# EAGLE schematic IGrevator (EAGLE 6.0)
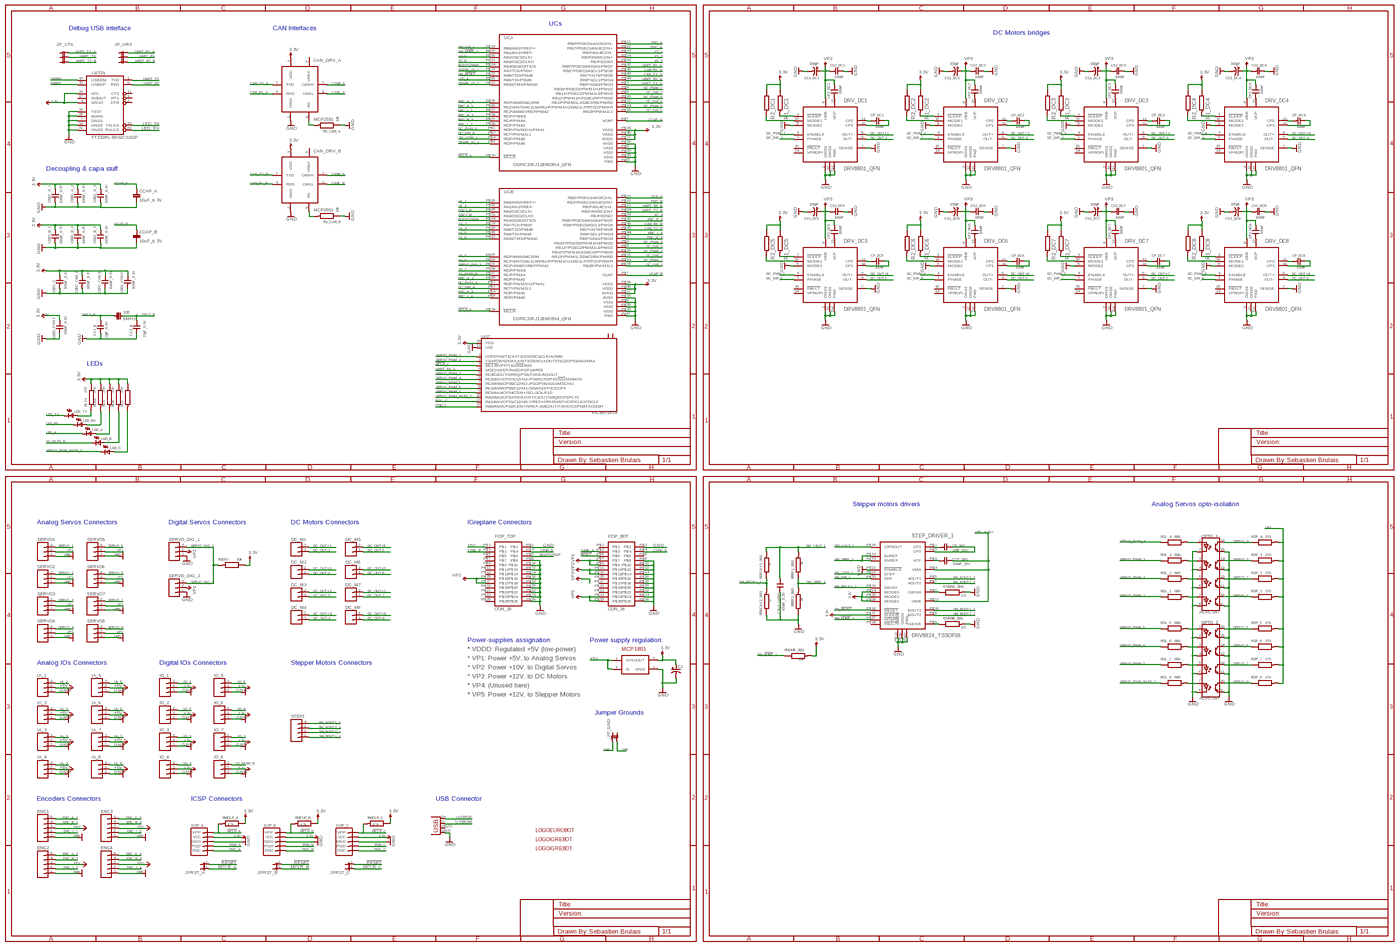
[diagram p0: schematic, sheet 1, overview]
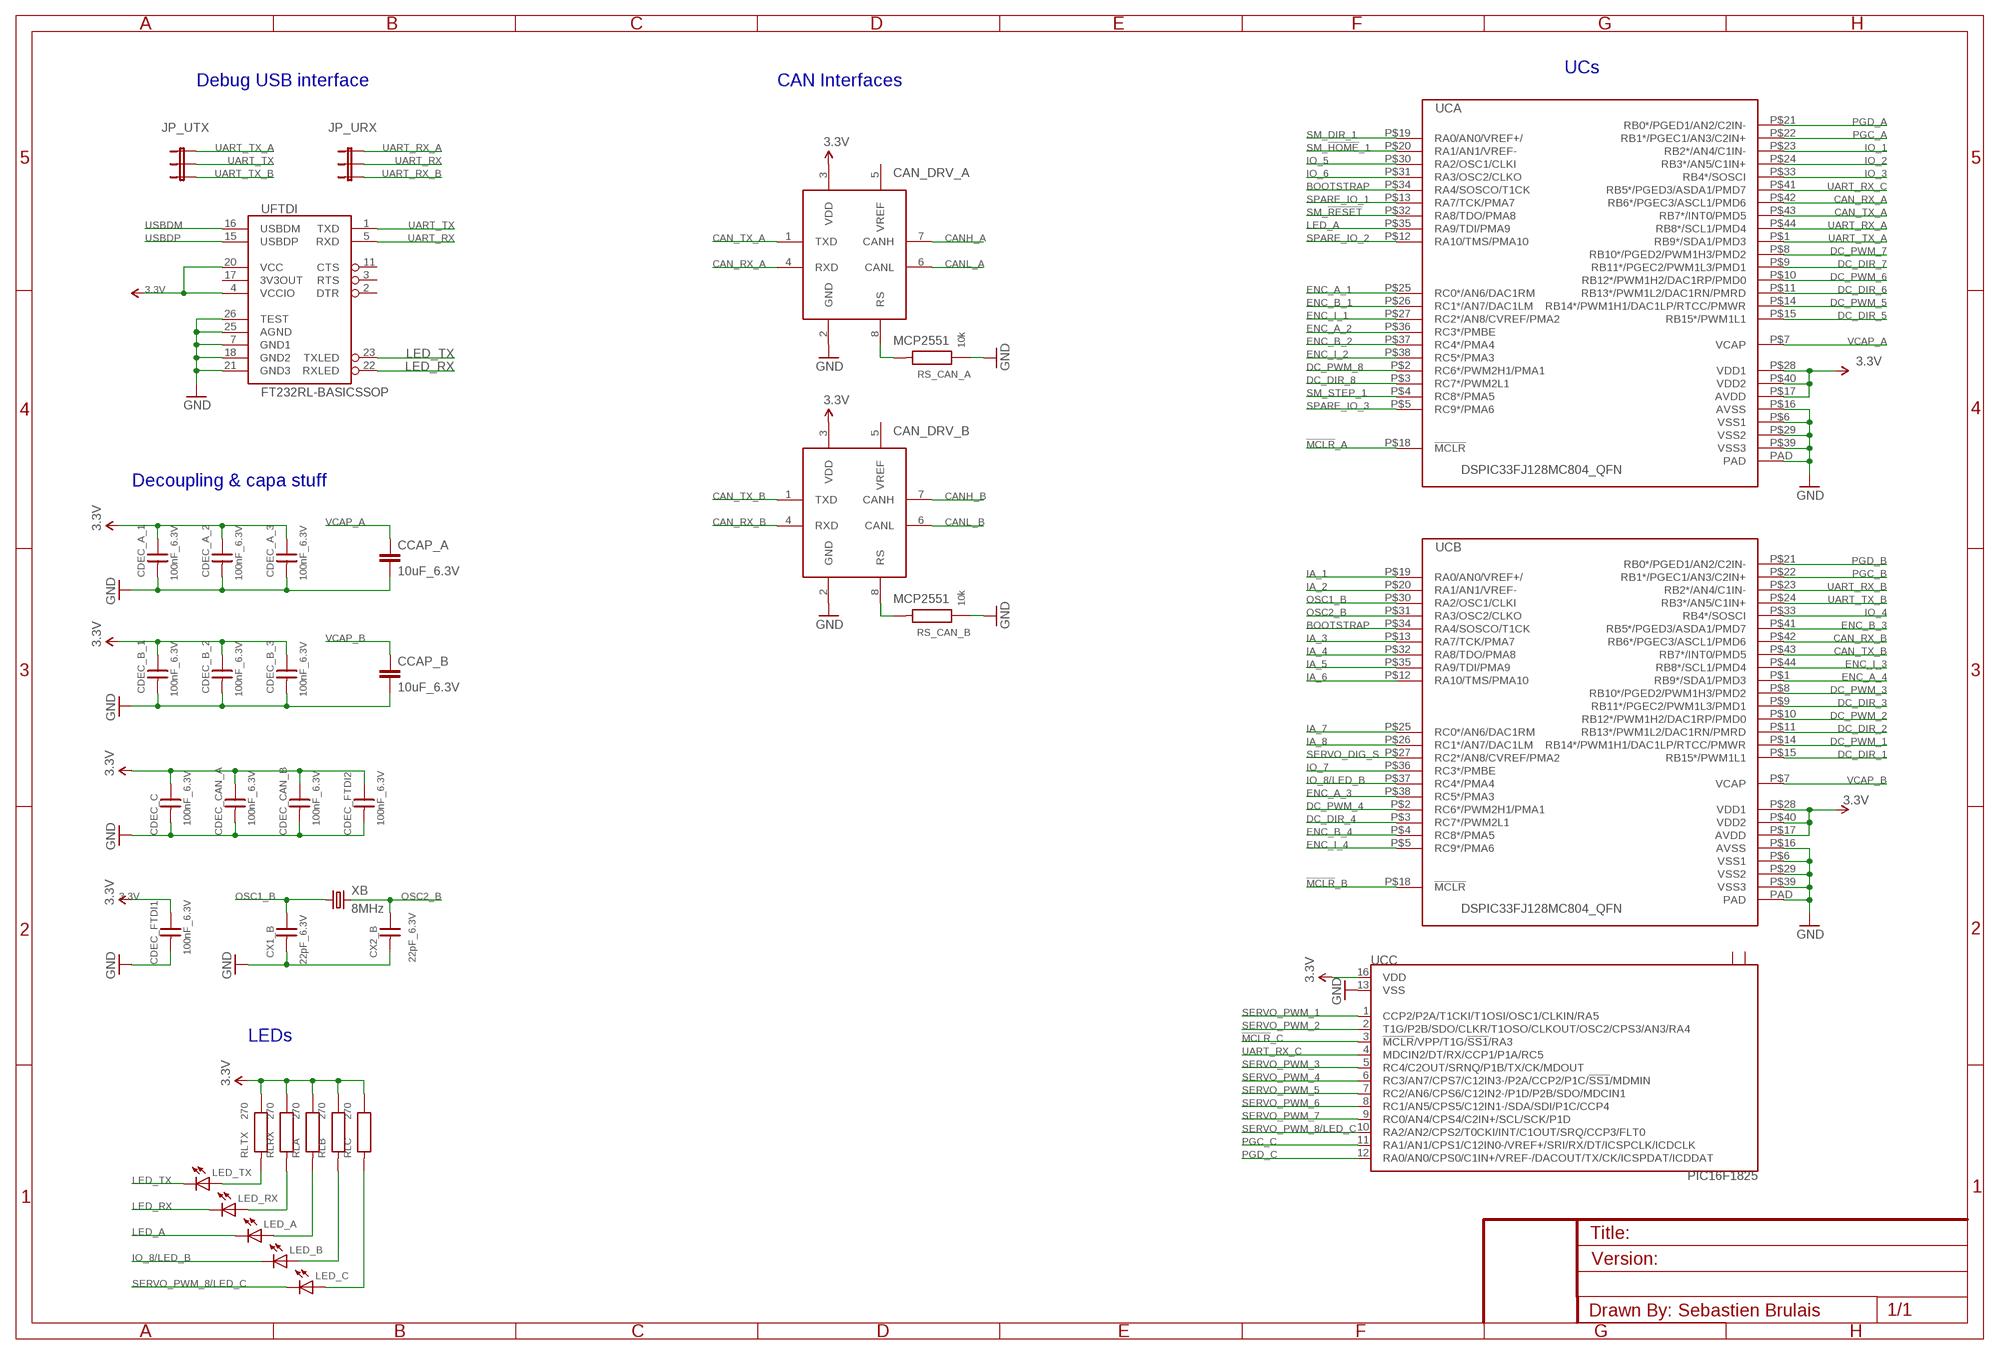
[diagram p1: schematic, sheet 1, part 1 of 4]
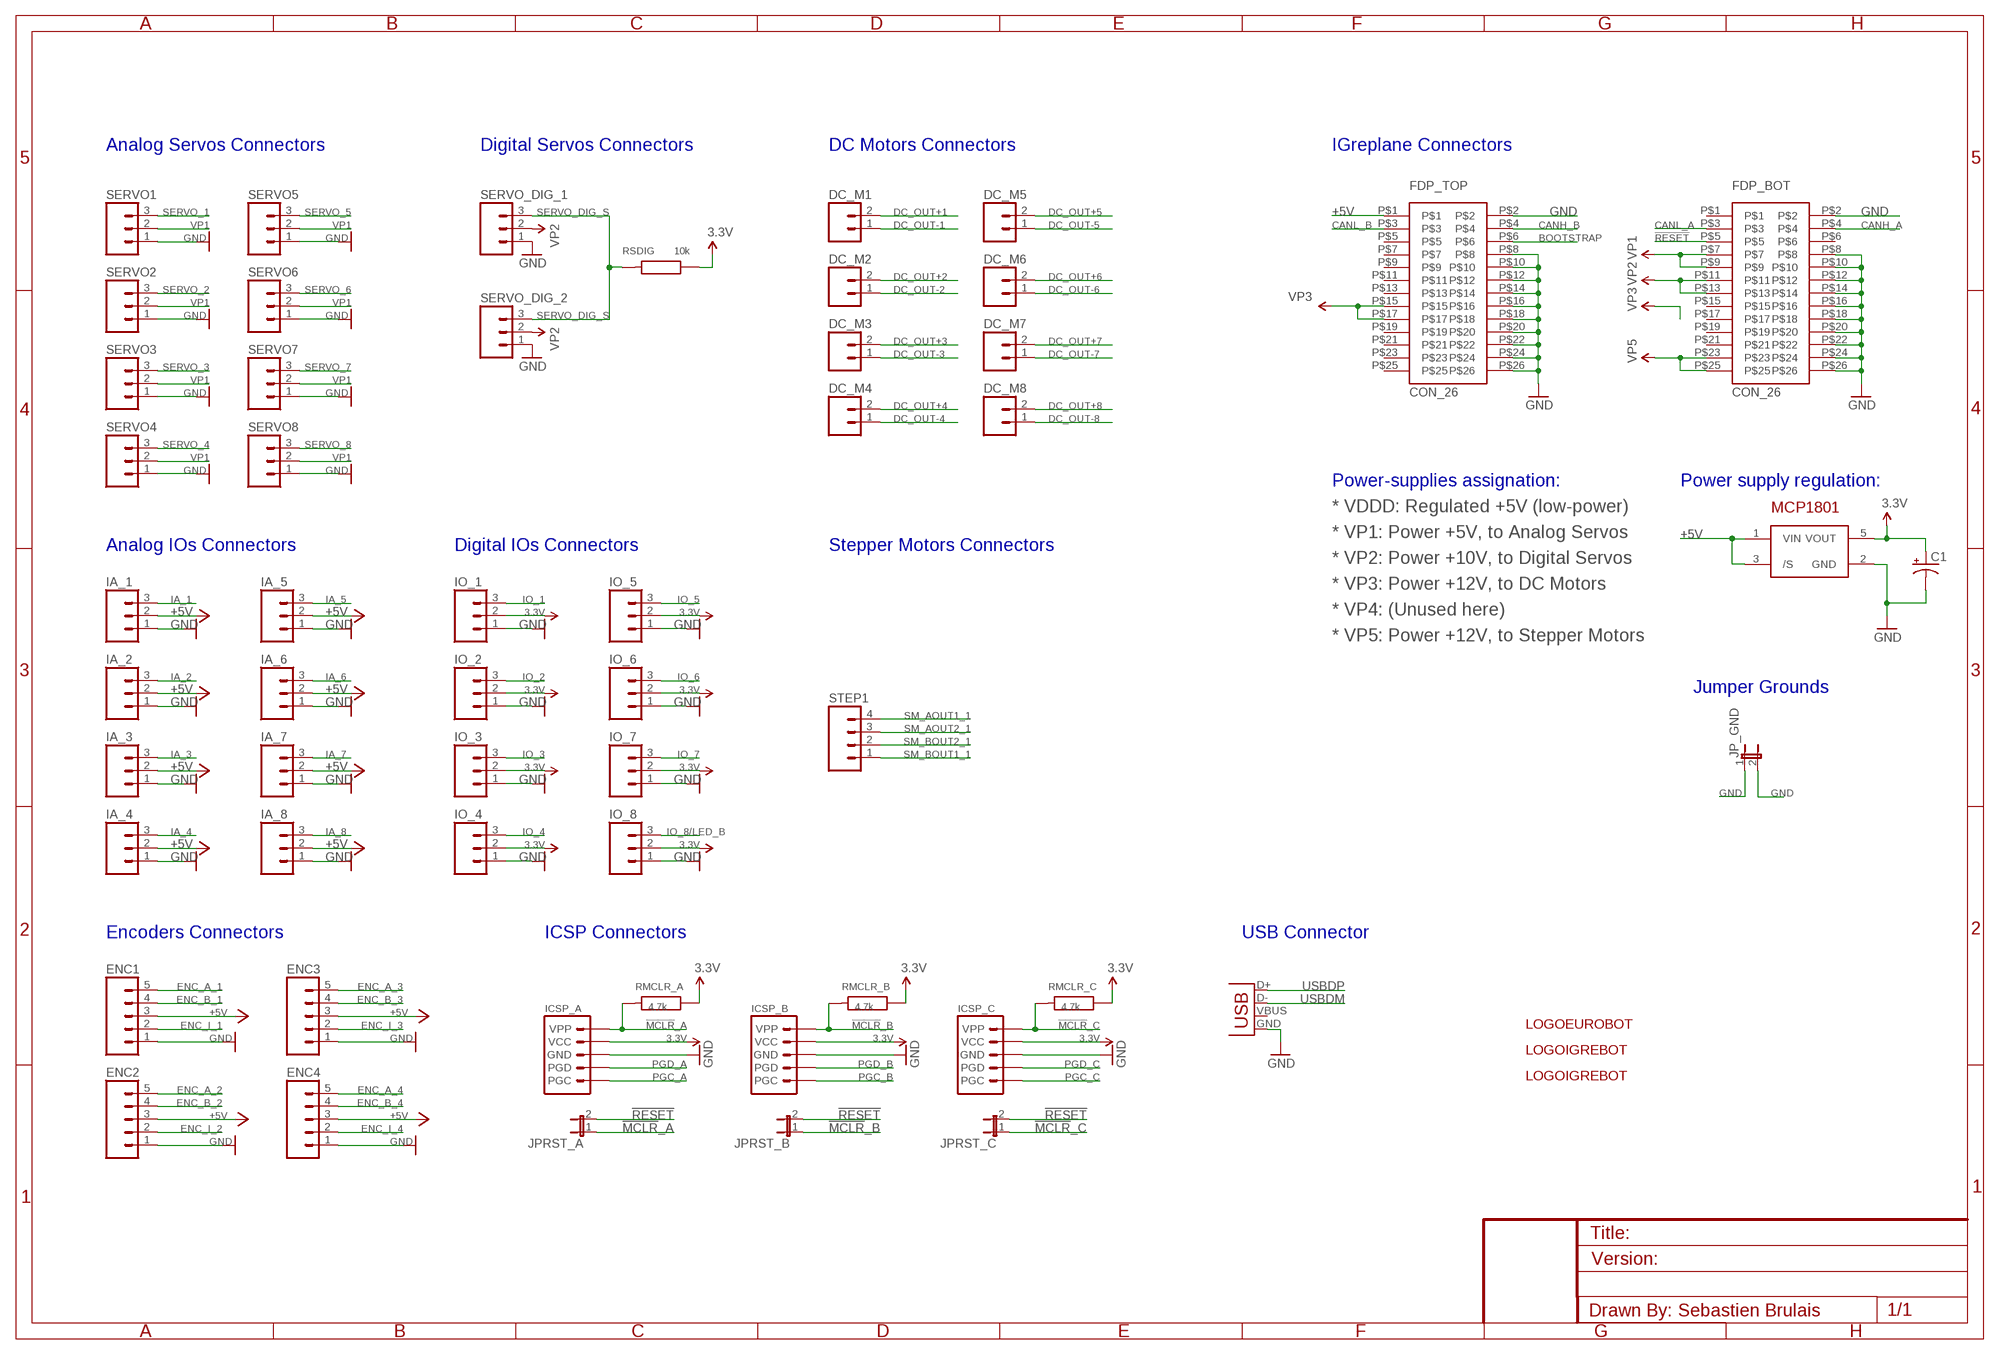
[diagram p2: schematic, sheet 1, part 2 of 4]
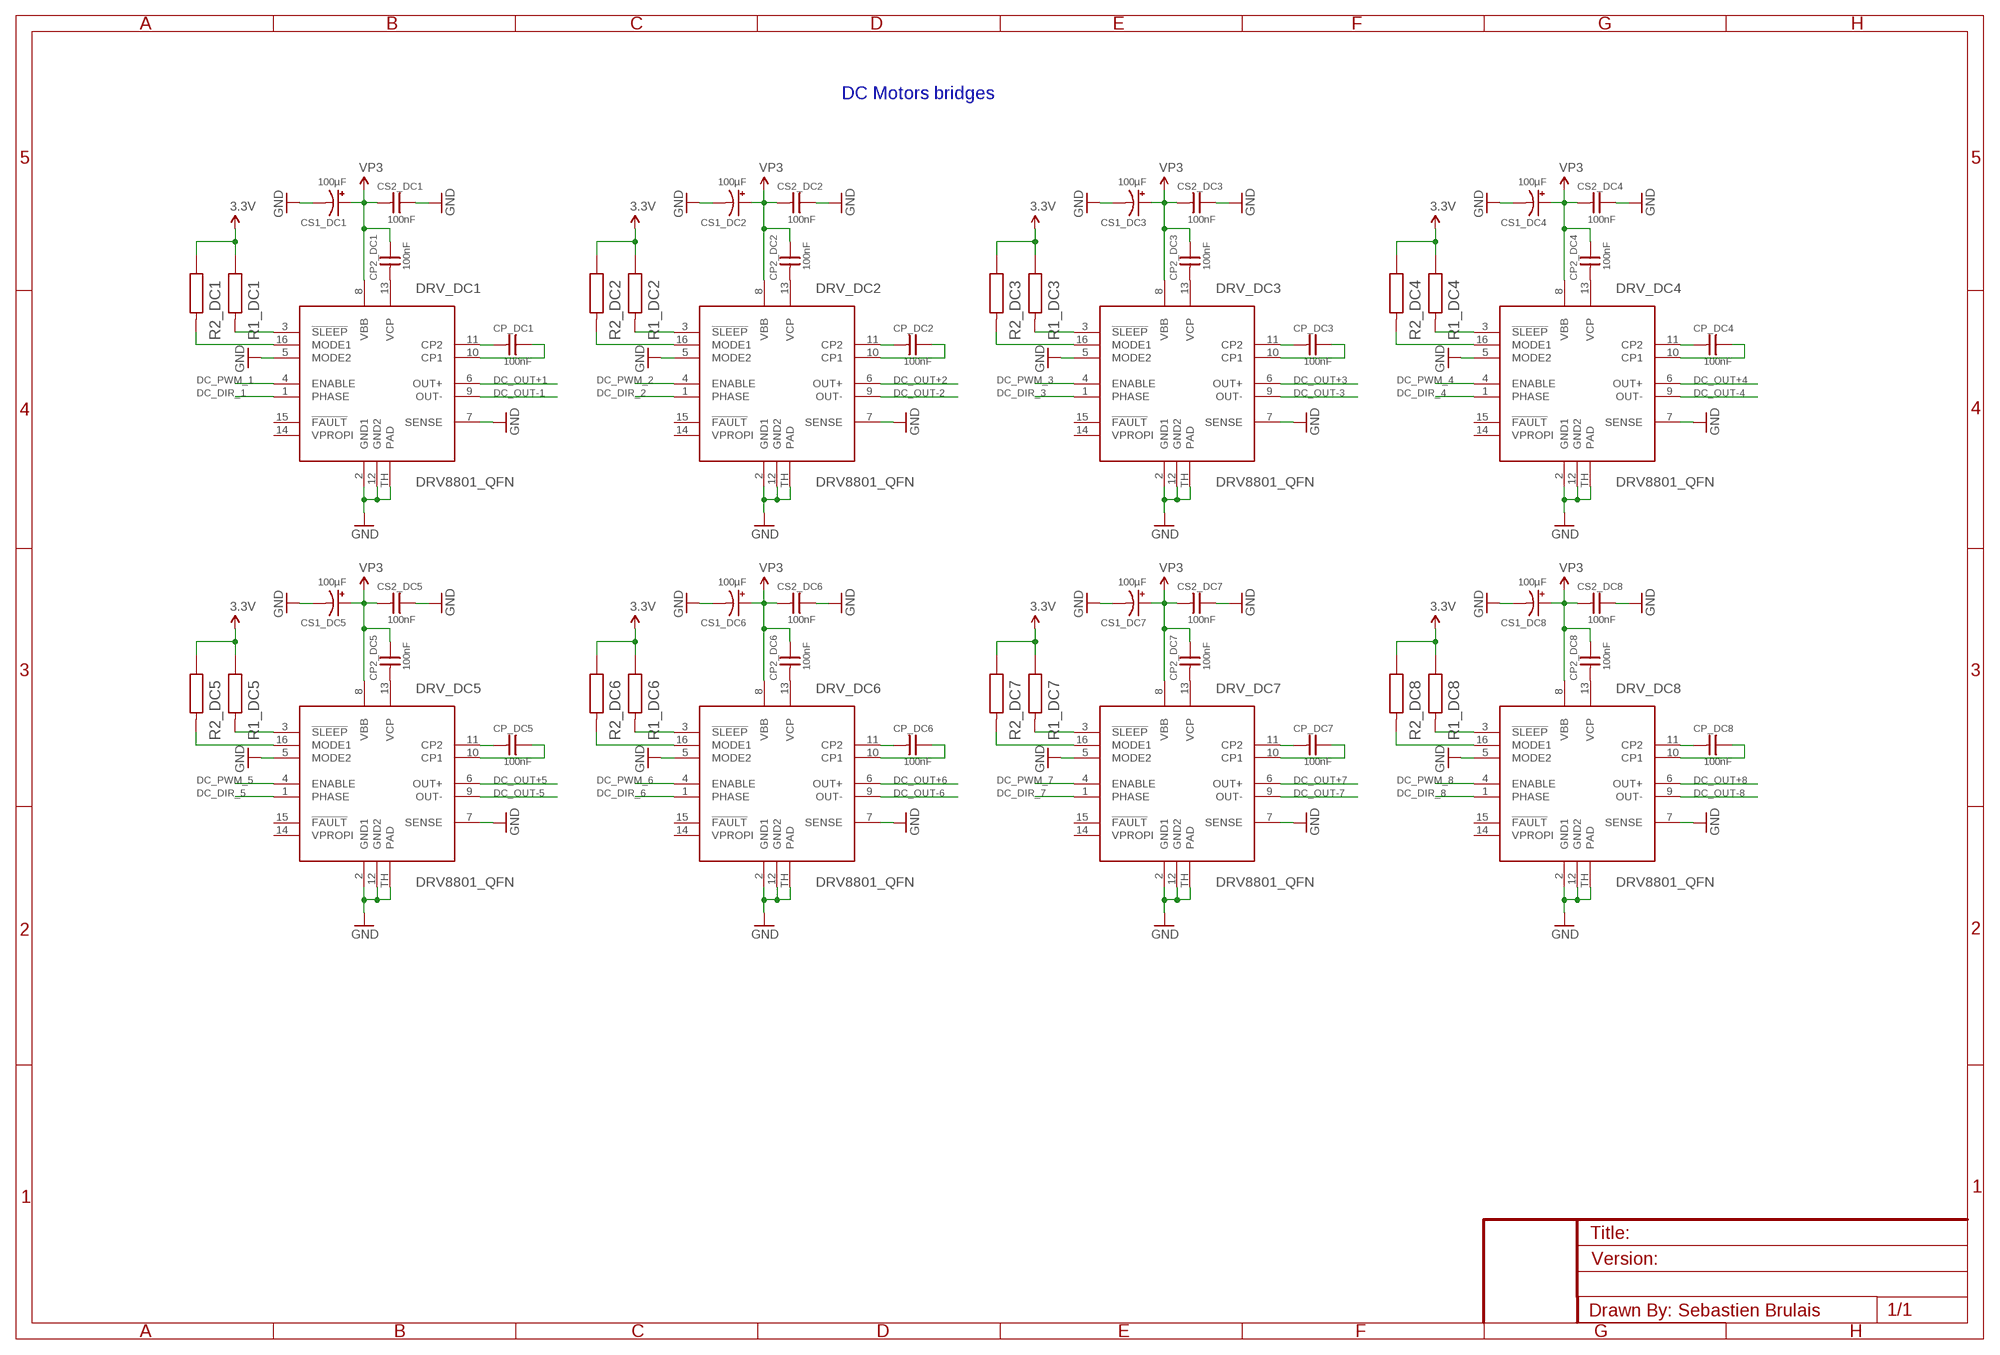
[diagram p3: schematic, sheet 1, part 3 of 4]
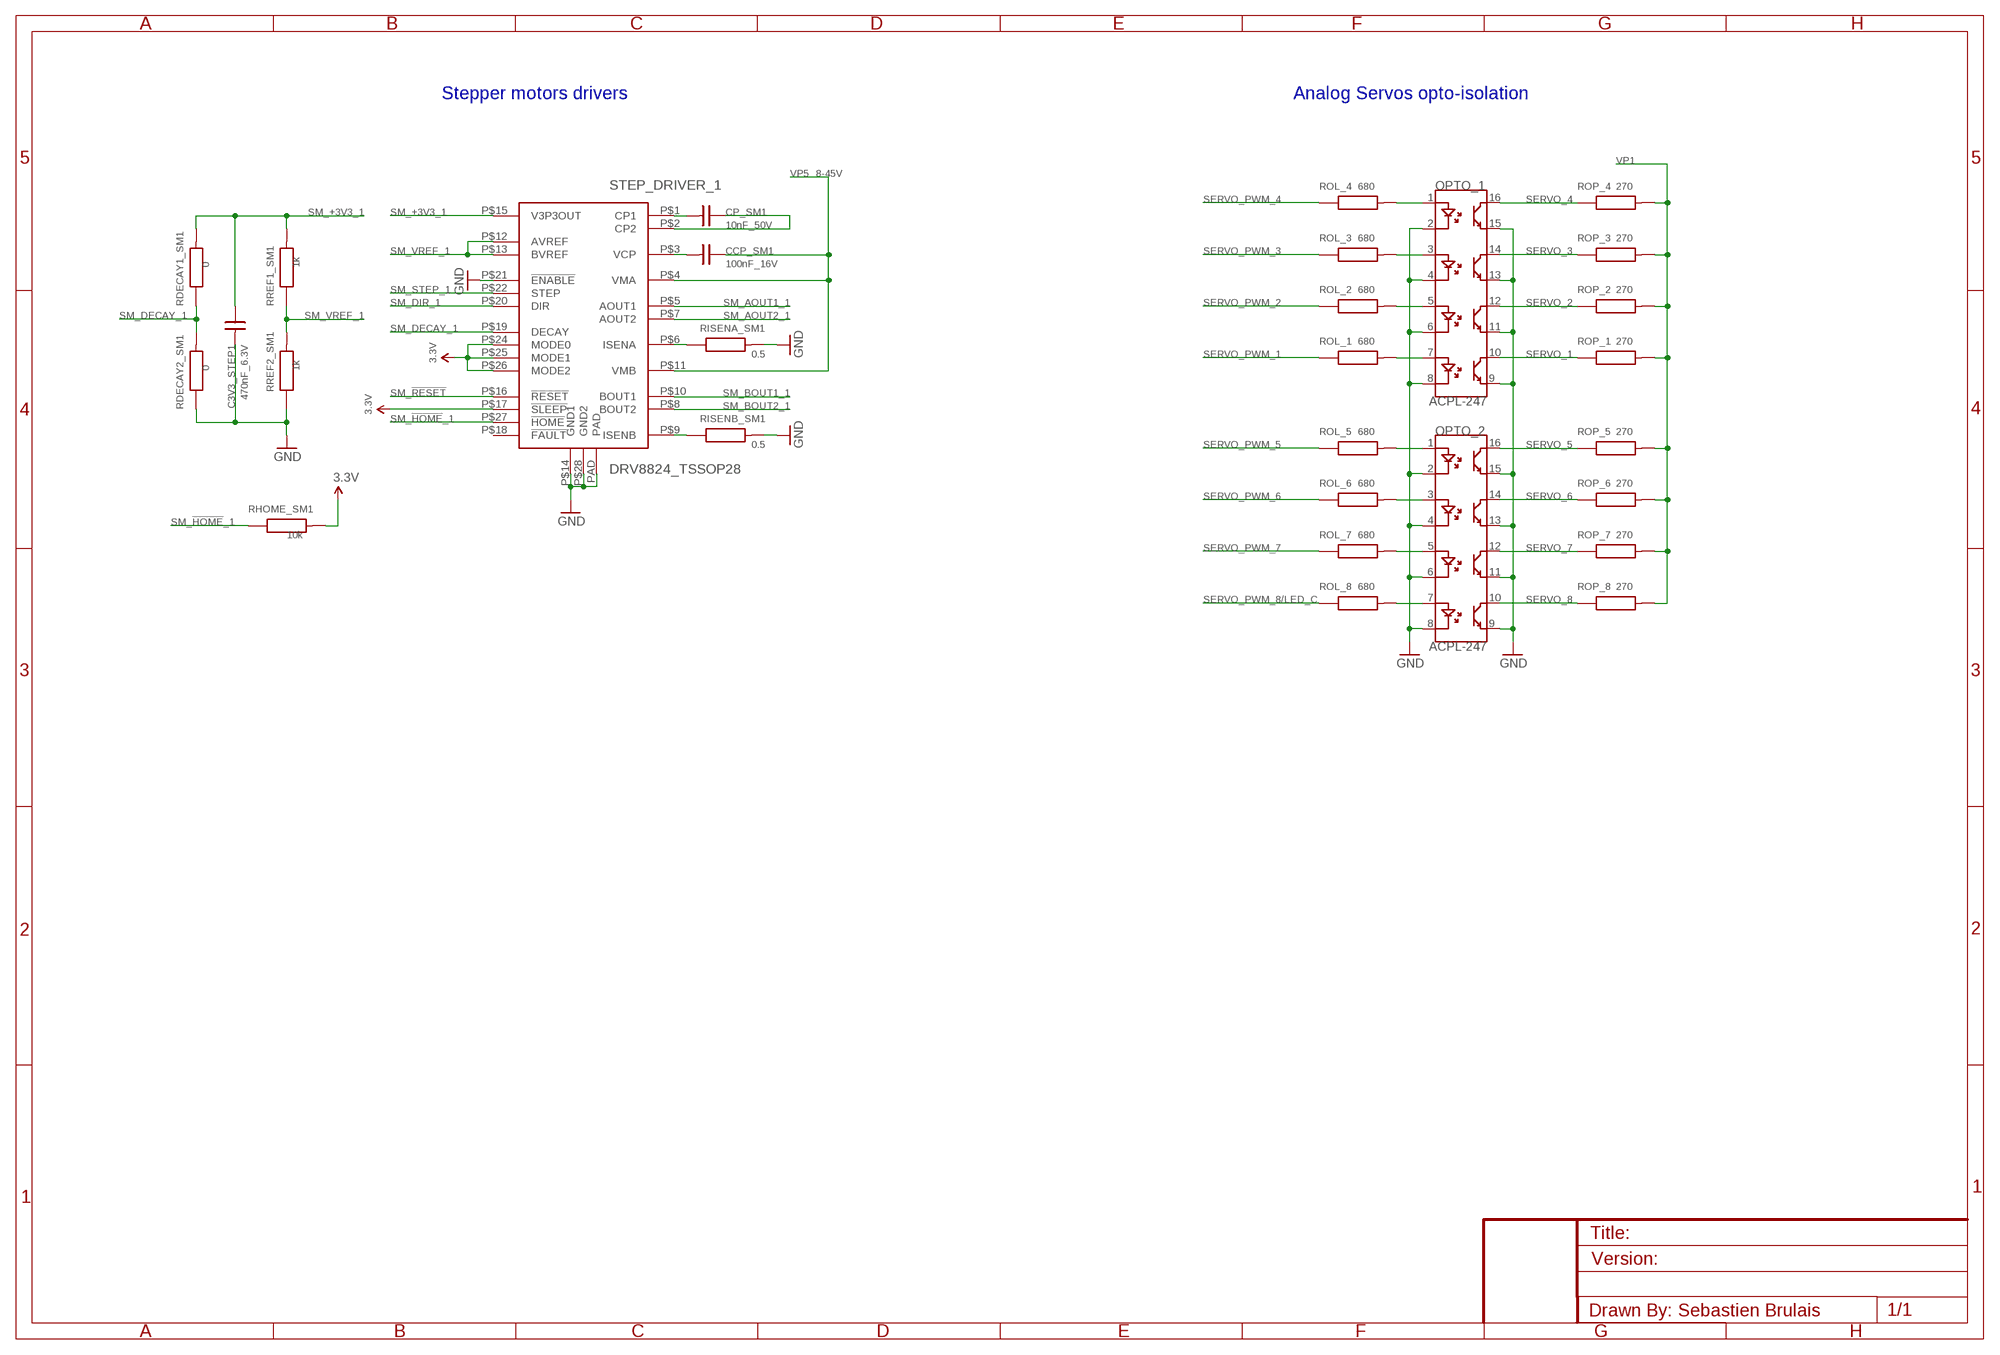
[diagram p4: schematic, sheet 1, part 4 of 4]

## Parts
C1  CAP_POLC  [PANASONIC_C]
C3V3_STEP1  470nF_6.3V  C0603  [R0603]
CAN_DRV_A  MCP2551  [SO-08]
CAN_DRV_B  MCP2551  [SO-08]
CCAP_A  10uF_6.3V  CAP1206  [1206]
CCAP_B  10uF_6.3V  CAP1206  [1206]
CCP_SM1  100nF_16V  C0603  [R0603]
CDEC_A_1  100nF_6.3V  C0603  [R0603]
CDEC_A_2  100nF_6.3V  C0603  [R0603]
CDEC_A_3  100nF_6.3V  C0603  [R0603]
CDEC_B_1  100nF_6.3V  C0603  [R0603]
CDEC_B_2  100nF_6.3V  C0603  [R0603]
CDEC_B_3  100nF_6.3V  C0603  [R0603]
CDEC_C  100nF_6.3V  C0603  [R0603]
CDEC_CAN_A  100nF_6.3V  C0603  [R0603]
CDEC_CAN_B  100nF_6.3V  C0603  [R0603]
CDEC_FTDI1  100nF_6.3V  C0603  [R0603]
CDEC_FTDI2  100nF_6.3V  C0603  [R0603]
CP2_DC1  100nF  C0603  [R0603]
CP2_DC2  100nF  C0603  [R0603]
CP2_DC3  100nF  C0603  [R0603]
CP2_DC4  100nF  C0603  [R0603]
CP2_DC5  100nF  C0603  [R0603]
CP2_DC6  100nF  C0603  [R0603]
CP2_DC7  100nF  C0603  [R0603]
CP2_DC8  100nF  C0603  [R0603]
CP_DC1  100nF  C0603  [R0603]
CP_DC2  100nF  C0603  [R0603]
CP_DC3  100nF  C0603  [R0603]
CP_DC4  100nF  C0603  [R0603]
CP_DC5  100nF  C0603  [R0603]
CP_DC6  100nF  C0603  [R0603]
CP_DC7  100nF  C0603  [R0603]
CP_DC8  100nF  C0603  [R0603]
CP_SM1  10nF_50V  C0603  [R0603]
CS1_DC1  100µF  CAP_POLD  [PANASONIC_D]
CS1_DC2  100µF  CAP_POLD  [PANASONIC_D]
CS1_DC3  100µF  CAP_POLD  [PANASONIC_D]
CS1_DC4  100µF  CAP_POLD  [PANASONIC_D]
CS1_DC5  100µF  CAP_POLD  [PANASONIC_D]
CS1_DC6  100µF  CAP_POLD  [PANASONIC_D]
CS1_DC7  100µF  CAP_POLD  [PANASONIC_D]
CS1_DC8  100µF  CAP_POLD  [PANASONIC_D]
CS2_DC1  100nF  C0603  [R0603]
CS2_DC2  100nF  C0603  [R0603]
CS2_DC3  100nF  C0603  [R0603]
CS2_DC4  100nF  C0603  [R0603]
CS2_DC5  100nF  C0603  [R0603]
CS2_DC6  100nF  C0603  [R0603]
CS2_DC7  100nF  C0603  [R0603]
CS2_DC8  100nF  C0603  [R0603]
CX1_B  22pF_6.3V  C0603  [R0603]
CX2_B  22pF_6.3V  C0603  [R0603]
DC_M1  M02PTH  [1X02]
DC_M2  M02PTH  [1X02]
DC_M3  M02PTH  [1X02]
DC_M4  M02PTH  [1X02]
DC_M5  M02PTH  [1X02]
DC_M6  M02PTH  [1X02]
DC_M7  M02PTH  [1X02]
DC_M8  M02PTH  [1X02]
DRV_DC1  DRV8801_QFN  [QFN16]
DRV_DC2  DRV8801_QFN  [QFN16]
DRV_DC3  DRV8801_QFN  [QFN16]
DRV_DC4  DRV8801_QFN  [QFN16]
DRV_DC5  DRV8801_QFN  [QFN16]
DRV_DC6  DRV8801_QFN  [QFN16]
DRV_DC7  DRV8801_QFN  [QFN16]
DRV_DC8  DRV8801_QFN  [QFN16]
ENC1  M05PTH  [1X05]
ENC2  M05PTH  [1X05]
ENC3  M05PTH  [1X05]
ENC4  M05PTH  [1X05]
FDP_BOT  CON_26  [HE10-26_90]
FDP_TOP  CON_26  [HE10-26_90]
IA_1  M03PTH  [1X03]
IA_2  M03PTH  [1X03]
IA_3  M03PTH  [1X03]
IA_4  M03PTH  [1X03]
IA_5  M03PTH  [1X03]
IA_6  M03PTH  [1X03]
IA_7  M03PTH  [1X03]
IA_8  M03PTH  [1X03]
ICSP_A  PIC-ICSP-MINI  [PIC-ICSP-MINI]
ICSP_B  PIC-ICSP-MINI  [PIC-ICSP-MINI]
ICSP_C  PIC-ICSP-MINI  [PIC-ICSP-MINI]
IO_1  M03PTH  [1X03]
IO_2  M03PTH  [1X03]
IO_3  M03PTH  [1X03]
IO_4  M03PTH  [1X03]
IO_5  M03PTH  [1X03]
IO_6  M03PTH  [1X03]
IO_7  M03PTH  [1X03]
IO_8  M03PTH  [1X03]
JP_GND  JUMPER-2PTH_LOCK  [1X02_LOCK]
JP_URX  JUMPER-3PTH  [1X03]
JP_UTX  JUMPER-3PTH  [1X03]
JPRST_A  JUMPER-2PTH_LOCK  [1X02_LOCK]
JPRST_B  JUMPER-2PTH_LOCK  [1X02_LOCK]
JPRST_C  JUMPER-2PTH_LOCK  [1X02_LOCK]
LED_A  LED0603  [LED-0603]
LED_B  LED0603  [LED-0603]
LED_C  LED0603  [LED-0603]
LED_RX  LED0603  [LED-0603]
LED_TX  LED0603  [LED-0603]
OPTO_1  ACPL-247  [SOIC16]
OPTO_2  ACPL-247  [SOIC16]
R1_DC1  R0603  [R0603]
R1_DC2  R0603  [R0603]
R1_DC3  R0603  [R0603]
R1_DC4  R0603  [R0603]
R1_DC5  R0603  [R0603]
R1_DC6  R0603  [R0603]
R1_DC7  R0603  [R0603]
R1_DC8  R0603  [R0603]
R2_DC1  R0603  [R0603]
R2_DC2  R0603  [R0603]
R2_DC3  R0603  [R0603]
R2_DC4  R0603  [R0603]
R2_DC5  R0603  [R0603]
R2_DC6  R0603  [R0603]
R2_DC7  R0603  [R0603]
R2_DC8  R0603  [R0603]
RDECAY1_SM1  0  R0603  [R0603]
RDECAY2_SM1  0  R0603  [R0603]
REG_3_3V  MCP1801  [SOT23-5L]
RHOME_SM1  10k  R0603  [R0603]
RISENA_SM1  0.5  R0603  [R0603]
RISENB_SM1  0.5  R0603  [R0603]
RLA  270  R0603  [R0603]
RLB  270  R0603  [R0603]
RLC  270  R0603  [R0603]
RLRX  270  R0603  [R0603]
RLTX  270  R0603  [R0603]
RMCLR_A  4.7k  R0603  [R0603]
RMCLR_B  4.7k  R0603  [R0603]
RMCLR_C  4.7k  R0603  [R0603]
ROL_1  680  R0603  [R0603]
ROL_2  680  R0603  [R0603]
ROL_3  680  R0603  [R0603]
ROL_4  680  R0603  [R0603]
ROL_5  680  R0603  [R0603]
ROL_6  680  R0603  [R0603]
ROL_7  680  R0603  [R0603]
ROL_8  680  R0603  [R0603]
ROP_1  270  R0603  [R0603]
ROP_2  270  R0603  [R0603]
ROP_3  270  R0603  [R0603]
ROP_4  270  R0603  [R0603]
ROP_5  270  R0603  [R0603]
ROP_6  270  R0603  [R0603]
ROP_7  270  R0603  [R0603]
ROP_8  270  R0603  [R0603]
RREF1_SM1  1k  R0603  [R0603]
RREF2_SM1  1k  R0603  [R0603]
RS_CAN_A  10k  R0603  [R0603]
RS_CAN_B  10k  R0603  [R0603]
RSDIG  10k  R0603  [R0603]
SERVO1  M03PTH  [1X03]
SERVO2  M03PTH  [1X03]
SERVO3  M03PTH  [1X03]
SERVO4  M03PTH  [1X03]
SERVO5  M03PTH  [1X03]
SERVO6  M03PTH  [1X03]
SERVO7  M03PTH  [1X03]
SERVO8  M03PTH  [1X03]
SERVO_DIG_1  M03PTH  [1X03]
SERVO_DIG_2  M03PTH  [1X03]
STEP1  M04PTH  [1X04]
STEP_DRIVER_1  DRV8824_TSSOP28  [TSSOP-28-PAD]
U$3  LOGOEUROBOT  [LOGO_EUROBOT_1]
U$5  LOGOIGREBOT  [LOGO_IGREBOT]
U$10  LOGOIGREBOT  [LOGO_IGREBOT]
UCA  DSPIC33FJ128MC804_QFN  [QFN44-8X8]
UCB  DSPIC33FJ128MC804_QFN  [QFN44-8X8]
UCC  PIC16F1825  [QFN16-0.65]
UFTDI  FT232RL-BASICSSOP  [SSOP28DB]
X1  USBSMD  [USB-MINIB]
XB  8MHz  XTAL4.8_1.8  [XTAL_4.9-1.8]

## Nets
3.3V: C1.+ CAN_DRV_A.3(VDD) CAN_DRV_B.3(VDD) CDEC_A_1.1 CDEC_A_2.1 CDEC_A_3.1 CDEC_B_1.1 CDEC_B_2.1 CDEC_B_3.1 CDEC_C.1 CDEC_CAN_A.1 CDEC_CAN_B.1 CDEC_FTDI1.1 CDEC_FTDI2.1 ICSP_A.2(VCC) ICSP_B.2(VCC) ICSP_C.2(VCC) IO_1.2 IO_2.2 IO_3.2 IO_4.2 IO_5.2 IO_6.2 IO_7.2 IO_8.2 R1_DC1.1 R1_DC2.1 R1_DC3.1 R1_DC4.1 R1_DC5.1 R1_DC6.1 R1_DC7.1 R1_DC8.1 R2_DC1.1 R2_DC2.1 R2_DC3.1 R2_DC4.1 R2_DC5.1 R2_DC6.1 R2_DC7.1 R2_DC8.1 REG_3_3V.5(VOUT) RHOME_SM1.2 RLA.1 RLB.1 RLC.1 RLRX.1 RLTX.1 RMCLR_A.1 RMCLR_B.1 RMCLR_C.1 RSDIG.1 STEP_DRIVER_1.P$17(!SLEEP) STEP_DRIVER_1.P$24(MODE0) STEP_DRIVER_1.P$25(MODE1) STEP_DRIVER_1.P$26(MODE2) UCA.P$17(AVDD) UCA.P$28(VDD1) UCA.P$40(VDD2) UCB.P$17(AVDD) UCB.P$28(VDD1) UCB.P$40(VDD2) UCC.16(VDD) UFTDI.4(VCCIO) UFTDI.20(VCC)
!MCLR!_A: ICSP_A.1(VPP) JPRST_A.1 RMCLR_A.2 UCA.P$18(!MCLR)
!MCLR!_B: ICSP_B.1(VPP) JPRST_B.1 RMCLR_B.2 UCB.P$18(!MCLR)
!MCLR!_C: ICSP_C.1(VPP) JPRST_C.1 RMCLR_C.2 UCC.3(!MCLR!/VPP/T1G/!SS1!/RA3)
!RESET: FDP_BOT.P$5 JPRST_A.2 JPRST_B.2 JPRST_C.2
+5V: ENC1.3 ENC2.3 ENC3.3 ENC4.3 FDP_TOP.P$1 IA_1.2 IA_2.2 IA_3.2 IA_4.2 IA_5.2 IA_6.2 IA_7.2 IA_8.2 REG_3_3V.1(VIN) REG_3_3V.3(/S)
BOOTSTRAP: FDP_TOP.P$6 UCA.P$34(RA4/SOSCO/T1CK) UCB.P$34(RA4/SOSCO/T1CK)
CAN_RX_A: CAN_DRV_A.4(RXD) UCA.P$42(RB6*/PGEC3/ASCL1/PMD6)
CAN_RX_B: CAN_DRV_B.4(RXD) UCB.P$42(RB6*/PGEC3/ASCL1/PMD6)
CAN_TX_A: CAN_DRV_A.1(TXD) UCA.P$43(RB7*/INT0/PMD5)
CAN_TX_B: CAN_DRV_B.1(TXD) UCB.P$43(RB7*/INT0/PMD5)
CANH_A: CAN_DRV_A.7(CANH) FDP_BOT.P$4
CANH_B: CAN_DRV_B.7(CANH) FDP_TOP.P$4
CANL_A: CAN_DRV_A.6(CANL) FDP_BOT.P$3
CANL_B: CAN_DRV_B.6(CANL) FDP_TOP.P$3
DC_DIR_1: DRV_DC1.1(PHASE) UCB.P$15(RB15*/PWM1L1)
DC_DIR_2: DRV_DC2.1(PHASE) UCB.P$11(RB13*/PWM1L2/DAC1RN/PMRD)
DC_DIR_3: DRV_DC3.1(PHASE) UCB.P$9(RB11*/PGEC2/PWM1L3/PMD1)
DC_DIR_4: DRV_DC4.1(PHASE) UCB.P$3(RC7*/PWM2L1)
DC_DIR_5: DRV_DC5.1(PHASE) UCA.P$15(RB15*/PWM1L1)
DC_DIR_6: DRV_DC6.1(PHASE) UCA.P$11(RB13*/PWM1L2/DAC1RN/PMRD)
DC_DIR_7: DRV_DC7.1(PHASE) UCA.P$9(RB11*/PGEC2/PWM1L3/PMD1)
DC_DIR_8: DRV_DC8.1(PHASE) UCA.P$3(RC7*/PWM2L1)
DC_OUT+1: DC_M1.2 DRV_DC1.6(OUT+)
DC_OUT+2: DC_M2.2 DRV_DC2.6(OUT+)
DC_OUT+3: DC_M3.2 DRV_DC3.6(OUT+)
DC_OUT+4: DC_M4.2 DRV_DC4.6(OUT+)
DC_OUT+5: DC_M5.2 DRV_DC5.6(OUT+)
DC_OUT+6: DC_M6.2 DRV_DC6.6(OUT+)
DC_OUT+7: DC_M7.2 DRV_DC7.6(OUT+)
DC_OUT+8: DC_M8.2 DRV_DC8.6(OUT+)
DC_OUT-1: DC_M1.1 DRV_DC1.9(OUT-)
DC_OUT-2: DC_M2.1 DRV_DC2.9(OUT-)
DC_OUT-3: DC_M3.1 DRV_DC3.9(OUT-)
DC_OUT-4: DC_M4.1 DRV_DC4.9(OUT-)
DC_OUT-5: DC_M5.1 DRV_DC5.9(OUT-)
DC_OUT-6: DC_M6.1 DRV_DC6.9(OUT-)
DC_OUT-7: DC_M7.1 DRV_DC7.9(OUT-)
DC_OUT-8: DC_M8.1 DRV_DC8.9(OUT-)
DC_PWM_1: DRV_DC1.4(ENABLE) UCB.P$14(RB14*/PWM1H1/DAC1LP/RTCC/PMWR)
DC_PWM_2: DRV_DC2.4(ENABLE) UCB.P$10(RB12*/PWM1H2/DAC1RP/PMD0)
DC_PWM_3: DRV_DC3.4(ENABLE) UCB.P$8(RB10*/PGED2/PWM1H3/PMD2)
DC_PWM_4: DRV_DC4.4(ENABLE) UCB.P$2(RC6*/PWM2H1/PMA1)
DC_PWM_5: DRV_DC5.4(ENABLE) UCA.P$14(RB14*/PWM1H1/DAC1LP/RTCC/PMWR)
DC_PWM_6: DRV_DC6.4(ENABLE) UCA.P$10(RB12*/PWM1H2/DAC1RP/PMD0)
DC_PWM_7: DRV_DC7.4(ENABLE) UCA.P$8(RB10*/PGED2/PWM1H3/PMD2)
DC_PWM_8: DRV_DC8.4(ENABLE) UCA.P$2(RC6*/PWM2H1/PMA1)
ENC_A_1: ENC1.5 UCA.P$25(RC0*/AN6/DAC1RM)
ENC_A_2: ENC2.5 UCA.P$36(RC3*/PMBE)
ENC_A_3: ENC3.5 UCB.P$38(RC5*/PMA3)
ENC_A_4: ENC4.5 UCB.P$1(RB9*/SDA1/PMD3)
ENC_B_1: ENC1.4 UCA.P$26(RC1*/AN7/DAC1LM)
ENC_B_2: ENC2.4 UCA.P$37(RC4*/PMA4)
ENC_B_3: ENC3.4 UCB.P$41(RB5*/PGED3/ASDA1/PMD7)
ENC_B_4: ENC4.4 UCB.P$4(RC8*/PMA5)
ENC_I_1: ENC1.2 UCA.P$27(RC2*/AN8/CVREF/PMA2)
ENC_I_2: ENC2.2 UCA.P$38(RC5*/PMA3)
ENC_I_3: ENC3.2 UCB.P$44(RB8*/SCL1/PMD4)
ENC_I_4: ENC4.2 UCB.P$5(RC9*/PMA6)
GND: C1.- C3V3_STEP1.2 CAN_DRV_A.2(GND) CAN_DRV_B.2(GND) CCAP_A.2 CCAP_B.2 CDEC_A_1.2 CDEC_A_2.2 CDEC_A_3.2 CDEC_B_1.2 CDEC_B_2.2 CDEC_B_3.2 CDEC_C.2 CDEC_CAN_A.2 CDEC_CAN_B.2 CDEC_FTDI1.2 CDEC_FTDI2.2 CS1_DC1.- CS1_DC2.- CS1_DC3.- CS1_DC4.- CS1_DC5.- CS1_DC6.- CS1_DC7.- CS1_DC8.- CS2_DC1.1 CS2_DC2.1 CS2_DC3.1 CS2_DC4.1 CS2_DC5.1 CS2_DC6.1 CS2_DC7.1 CS2_DC8.1 CX1_B.2 CX2_B.2 DRV_DC1.2(GND1) DRV_DC1.5(MODE2) DRV_DC1.7(SENSE) DRV_DC1.12(GND2) DRV_DC1.TH(PAD) DRV_DC2.2(GND1) DRV_DC2.5(MODE2) DRV_DC2.7(SENSE) DRV_DC2.12(GND2) DRV_DC2.TH(PAD) DRV_DC3.2(GND1) DRV_DC3.5(MODE2) DRV_DC3.7(SENSE) DRV_DC3.12(GND2) DRV_DC3.TH(PAD) DRV_DC4.2(GND1) DRV_DC4.5(MODE2) DRV_DC4.7(SENSE) DRV_DC4.12(GND2) DRV_DC4.TH(PAD) DRV_DC5.2(GND1) DRV_DC5.5(MODE2) DRV_DC5.7(SENSE) DRV_DC5.12(GND2) DRV_DC5.TH(PAD) DRV_DC6.2(GND1) DRV_DC6.5(MODE2) DRV_DC6.7(SENSE) DRV_DC6.12(GND2) DRV_DC6.TH(PAD) DRV_DC7.2(GND1) DRV_DC7.5(MODE2) DRV_DC7.7(SENSE) DRV_DC7.12(GND2) DRV_DC7.TH(PAD) DRV_DC8.2(GND1) DRV_DC8.5(MODE2) DRV_DC8.7(SENSE) DRV_DC8.12(GND2) DRV_DC8.TH(PAD) ENC1.1 ENC2.1 ENC3.1 ENC4.1 FDP_BOT.P$2 FDP_BOT.P$8 FDP_BOT.P$10 FDP_BOT.P$12 FDP_BOT.P$14 FDP_BOT.P$16 FDP_BOT.P$18 FDP_BOT.P$20 FDP_BOT.P$22 FDP_BOT.P$24 FDP_BOT.P$26 FDP_TOP.P$2 FDP_TOP.P$8 FDP_TOP.P$10 FDP_TOP.P$12 FDP_TOP.P$14 FDP_TOP.P$16 FDP_TOP.P$18 FDP_TOP.P$20 FDP_TOP.P$22 FDP_TOP.P$24 FDP_TOP.P$26 IA_1.1 IA_2.1 IA_3.1 IA_4.1 IA_5.1 IA_6.1 IA_7.1 IA_8.1 ICSP_A.3(GND) ICSP_B.3(GND) ICSP_C.3(GND) IO_1.1 IO_2.1 IO_3.1 IO_4.1 IO_5.1 IO_6.1 IO_7.1 IO_8.1 JP_GND.1 JP_GND.2 OPTO_1.2 OPTO_1.4 OPTO_1.6 OPTO_1.8 OPTO_1.9 OPTO_1.11 OPTO_1.13 OPTO_1.15 OPTO_2.2 OPTO_2.4 OPTO_2.6 OPTO_2.8 OPTO_2.9 OPTO_2.11 OPTO_2.13 OPTO_2.15 RDECAY2_SM1.1 REG_3_3V.2(GND) RISENA_SM1.2 RISENB_SM1.2 RREF2_SM1.1 RS_CAN_A.1 RS_CAN_B.1 SERVO1.1 SERVO2.1 SERVO3.1 SERVO4.1 SERVO5.1 SERVO6.1 SERVO7.1 SERVO8.1 SERVO_DIG_1.1 SERVO_DIG_2.1 STEP_DRIVER_1.P$14(GND1) STEP_DRIVER_1.P$21(!ENABLE) STEP_DRIVER_1.P$28(GND2) STEP_DRIVER_1.PAD UCA.P$6(VSS1) UCA.P$16(AVSS) UCA.P$29(VSS2) UCA.P$39(VSS3) UCA.PAD UCB.P$6(VSS1) UCB.P$16(AVSS) UCB.P$29(VSS2) UCB.P$39(VSS3) UCB.PAD UCC.13(VSS) UFTDI.7(GND1) UFTDI.18(GND2) UFTDI.21(GND3) UFTDI.25(AGND) UFTDI.26(TEST) X1.GND
IA_1: IA_1.3 UCB.P$19(RA0/AN0/VREF+/)
IA_2: IA_2.3 UCB.P$20(RA1/AN1/VREF-)
IA_3: IA_3.3 UCB.P$13(RA7/TCK/PMA7)
IA_4: IA_4.3 UCB.P$32(RA8/TDO/PMA8)
IA_5: IA_5.3 UCB.P$35(RA9/TDI/PMA9)
IA_6: IA_6.3 UCB.P$12(RA10/TMS/PMA10)
IA_7: IA_7.3 UCB.P$25(RC0*/AN6/DAC1RM)
IA_8: IA_8.3 UCB.P$26(RC1*/AN7/DAC1LM)
IO_1: IO_1.3 UCA.P$23(RB2*/AN4/C1IN-)
IO_2: IO_2.3 UCA.P$24(RB3*/AN5/C1IN+)
IO_3: IO_3.3 UCA.P$33(RB4*/SOSCI)
IO_4: IO_4.3 UCB.P$33(RB4*/SOSCI)
IO_5: IO_5.3 UCA.P$30(RA2/OSC1/CLKI)
IO_6: IO_6.3 UCA.P$31(RA3/OSC2/CLKO)
IO_7: IO_7.3 UCB.P$36(RC3*/PMBE)
IO_8/LED_B: IO_8.3 LED_B.C UCB.P$37(RC4*/PMA4)
LED_A: LED_A.C UCA.P$35(RA9/TDI/PMA9)
LED_RX: LED_RX.C UFTDI.22(RXLED)
LED_TX: LED_TX.C UFTDI.23(TXLED)
N$4: DRV_DC1.3(!SLEEP) R1_DC1.2
N$5: CAN_DRV_A.8(RS) RS_CAN_A.2
N$6: CAN_DRV_B.8(RS) RS_CAN_B.2
N$8: OPTO_1.1 ROL_4.2
N$9: DRV_DC1.16(MODE1) R2_DC1.2
N$11: OPTO_1.3 ROL_3.2
N$12: DRV_DC2.3(!SLEEP) R1_DC2.2
N$13: DRV_DC2.16(MODE1) R2_DC2.2
N$15: CP_SM1.2 STEP_DRIVER_1.P$1(CP1)
N$16: RISENA_SM1.1 STEP_DRIVER_1.P$6(ISENA)
N$17: CP_DC2.2 DRV_DC2.11(CP2)
N$20: CP_SM1.1 STEP_DRIVER_1.P$2(CP2)
N$22: CCP_SM1.2 STEP_DRIVER_1.P$3(VCP)
N$30: CP_DC1.2 DRV_DC1.11(CP2)
N$31: CP_DC1.1 DRV_DC1.10(CP1)
N$32: CP2_DC1.2 DRV_DC1.13(VCP)
N$33: CP_DC2.1 DRV_DC2.10(CP1)
N$34: CP2_DC2.2 DRV_DC2.13(VCP)
N$35: DRV_DC3.3(!SLEEP) R1_DC3.2
N$36: DRV_DC3.16(MODE1) R2_DC3.2
N$37: CP_DC3.2 DRV_DC3.11(CP2)
N$38: CP_DC3.1 DRV_DC3.10(CP1)
N$39: CP2_DC3.2 DRV_DC3.13(VCP)
N$40: DRV_DC4.3(!SLEEP) R1_DC4.2
N$41: DRV_DC4.16(MODE1) R2_DC4.2
N$42: CP_DC4.2 DRV_DC4.11(CP2)
N$43: CP_DC4.1 DRV_DC4.10(CP1)
N$44: CP2_DC4.2 DRV_DC4.13(VCP)
N$45: DRV_DC5.3(!SLEEP) R1_DC5.2
N$46: DRV_DC5.16(MODE1) R2_DC5.2
N$47: CP_DC5.2 DRV_DC5.11(CP2)
N$48: CP_DC5.1 DRV_DC5.10(CP1)
N$49: CP2_DC5.2 DRV_DC5.13(VCP)
N$50: DRV_DC6.3(!SLEEP) R1_DC6.2
N$51: DRV_DC6.16(MODE1) R2_DC6.2
N$52: CP_DC6.2 DRV_DC6.11(CP2)
N$53: CP_DC6.1 DRV_DC6.10(CP1)
N$54: CP2_DC6.2 DRV_DC6.13(VCP)
N$55: DRV_DC7.3(!SLEEP) R1_DC7.2
N$56: DRV_DC7.16(MODE1) R2_DC7.2
N$57: CP_DC7.2 DRV_DC7.11(CP2)
N$58: CP_DC7.1 DRV_DC7.10(CP1)
N$59: CP2_DC7.2 DRV_DC7.13(VCP)
N$60: DRV_DC8.3(!SLEEP) R1_DC8.2
N$61: DRV_DC8.16(MODE1) R2_DC8.2
N$62: CP_DC8.2 DRV_DC8.11(CP2)
N$63: CP_DC8.1 DRV_DC8.10(CP1)
N$64: CP2_DC8.2 DRV_DC8.13(VCP)
N$65: RISENB_SM1.1 STEP_DRIVER_1.P$9(ISENB)
N$69: OPTO_1.5 ROL_2.2
N$70: LED_C.A RLC.2
N$71: LED_B.A RLB.2
N$72: LED_A.A RLA.2
N$74: OPTO_1.7 ROL_1.2
N$75: OPTO_2.1 ROL_5.2
N$76: LED_TX.A RLTX.2
N$77: LED_RX.A RLRX.2
N$78: OPTO_2.3 ROL_6.2
N$79: OPTO_2.5 ROL_7.2
N$80: OPTO_2.7 ROL_8.2
OSC1_B: CX1_B.1 UCB.P$30(RA2/OSC1/CLKI) XB.P$1
OSC2_B: CX2_B.1 UCB.P$31(RA3/OSC2/CLKO) XB.P$2
PGC_A: ICSP_A.5(PGC) UCA.P$22(RB1*/PGEC1/AN3/C2IN+)
PGC_B: ICSP_B.5(PGC) UCB.P$22(RB1*/PGEC1/AN3/C2IN+)
PGC_C: ICSP_C.5(PGC) UCC.11(RA1/AN1/CPS1/C12IN0-/VREF+/SRI/RX/DT/ICSPCLK/ICDCLK)
PGD_A: ICSP_A.4(PGD) UCA.P$21(RB0*/PGED1/AN2/C2IN-)
PGD_B: ICSP_B.4(PGD) UCB.P$21(RB0*/PGED1/AN2/C2IN-)
PGD_C: ICSP_C.4(PGD) UCC.12(RA0/AN0/CPS0/C1IN+/VREF-/DACOUT/TX/CK/ICSPDAT/ICDDAT)
SERVO_1: OPTO_1.10 ROP_1.1 SERVO1.3
SERVO_2: OPTO_1.12 ROP_2.1 SERVO2.3
SERVO_3: OPTO_1.14 ROP_3.1 SERVO3.3
SERVO_4: OPTO_1.16 ROP_4.1 SERVO4.3
SERVO_5: OPTO_2.16 ROP_5.1 SERVO5.3
SERVO_6: OPTO_2.14 ROP_6.1 SERVO6.3
SERVO_7: OPTO_2.12 ROP_7.1 SERVO7.3
SERVO_8: OPTO_2.10 ROP_8.1 SERVO8.3
SERVO_DIG_S: RSDIG.2 SERVO_DIG_1.3 SERVO_DIG_2.3 UCB.P$27(RC2*/AN8/CVREF/PMA2)
SERVO_PWM_1: ROL_1.1 UCC.1(CCP2/P2A/T1CKI/T1OSI/OSC1/CLKIN/RA5)
SERVO_PWM_2: ROL_2.1 UCC.2(T1G/P2B/SDO/CLKR/T1OSO/CLKOUT/OSC2/CPS3/AN3/RA4)
SERVO_PWM_3: ROL_3.1 UCC.5(RC4/C2OUT/SRNQ/P1B/TX/CK/MDOUT)
SERVO_PWM_4: ROL_4.1 UCC.6(RC3/AN7/CPS7/C12IN3-/P2A/CCP2/P1C/!SS1!/MDMIN)
SERVO_PWM_5: ROL_5.1 UCC.7(RC2/AN6/CPS6/C12IN2-/P1D/P2B/SDO/MDCIN1)
SERVO_PWM_6: ROL_6.1 UCC.8(RC1/AN5/CPS5/C12IN1-/SDA/SDI/P1C/CCP4)
SERVO_PWM_7: ROL_7.1 UCC.9(RC0/AN4/CPS4/C2IN+/SCL/SCK/P1D)
SERVO_PWM_8/LED_C: LED_C.C ROL_8.1 UCC.10(RA2/AN2/CPS2/T0CKI/INT/C1OUT/SRQ/CCP3/FLT0)
SM_!HOME!_1: RHOME_SM1.1 STEP_DRIVER_1.P$27(!HOME) UCA.P$20(RA1/AN1/VREF-)
SM_!RESET!: STEP_DRIVER_1.P$16(!RESET) UCA.P$32(RA8/TDO/PMA8)
SM_+3V3_1: C3V3_STEP1.1 RDECAY1_SM1.2 RREF1_SM1.2 STEP_DRIVER_1.P$15(V3P3OUT)
SM_AOUT1_1: STEP1.4 STEP_DRIVER_1.P$5(AOUT1)
SM_AOUT2_1: STEP1.3 STEP_DRIVER_1.P$7(AOUT2)
SM_BOUT1_1: STEP1.1 STEP_DRIVER_1.P$10(BOUT1)
SM_BOUT2_1: STEP1.2 STEP_DRIVER_1.P$8(BOUT2)
SM_DECAY_1: RDECAY1_SM1.1 RDECAY2_SM1.2 STEP_DRIVER_1.P$19(DECAY)
SM_DIR_1: STEP_DRIVER_1.P$20(DIR) UCA.P$19(RA0/AN0/VREF+/)
SM_STEP_1: STEP_DRIVER_1.P$22(STEP) UCA.P$4(RC8*/PMA5)
SM_VREF_1: RREF1_SM1.1 RREF2_SM1.2 STEP_DRIVER_1.P$12(AVREF) STEP_DRIVER_1.P$13(BVREF)
SPARE_IO_1: UCA.P$13(RA7/TCK/PMA7)
SPARE_IO_2: UCA.P$12(RA10/TMS/PMA10)
SPARE_IO_3: UCA.P$5(RC9*/PMA6)
UART_RX: JP_URX.2 UFTDI.5(RXD)
UART_RX_A: JP_URX.1 UCA.P$44(RB8*/SCL1/PMD4)
UART_RX_B: JP_URX.3 UCB.P$23(RB2*/AN4/C1IN-)
UART_RX_C: UCA.P$41(RB5*/PGED3/ASDA1/PMD7) UCC.4(MDCIN2/DT/RX/CCP1/P1A/RC5)
UART_TX: JP_UTX.2 UFTDI.1(TXD)
UART_TX_A: JP_UTX.1 UCA.P$1(RB9*/SDA1/PMD3)
UART_TX_B: JP_UTX.3 UCB.P$24(RB3*/AN5/C1IN+)
USBDM: UFTDI.16(USBDM) X1.D-
USBDP: UFTDI.15(USBDP) X1.D+
VCAP_A: CCAP_A.1 UCA.P$7(VCAP)
VCAP_B: CCAP_B.1 UCB.P$7(VCAP)
VP1: FDP_BOT.P$7 FDP_BOT.P$9 ROP_1.2 ROP_2.2 ROP_3.2 ROP_4.2 ROP_5.2 ROP_6.2 ROP_7.2 ROP_8.2 SERVO1.2 SERVO2.2 SERVO3.2 SERVO4.2 SERVO5.2 SERVO6.2 SERVO7.2 SERVO8.2
VP2: FDP_BOT.P$11 FDP_BOT.P$13 SERVO_DIG_1.2 SERVO_DIG_2.2
VP3: CP2_DC1.1 CP2_DC2.1 CP2_DC3.1 CP2_DC4.1 CP2_DC5.1 CP2_DC6.1 CP2_DC7.1 CP2_DC8.1 CS1_DC1.+ CS1_DC2.+ CS1_DC3.+ CS1_DC4.+ CS1_DC5.+ CS1_DC6.+ CS1_DC7.+ CS1_DC8.+ CS2_DC1.2 CS2_DC2.2 CS2_DC3.2 CS2_DC4.2 CS2_DC5.2 CS2_DC6.2 CS2_DC7.2 CS2_DC8.2 DRV_DC1.8(VBB) DRV_DC2.8(VBB) DRV_DC3.8(VBB) DRV_DC4.8(VBB) DRV_DC5.8(VBB) DRV_DC6.8(VBB) DRV_DC7.8(VBB) DRV_DC8.8(VBB) FDP_TOP.P$15 FDP_TOP.P$17
VP5: CCP_SM1.1 FDP_BOT.P$23 FDP_BOT.P$25 STEP_DRIVER_1.P$4(VMA) STEP_DRIVER_1.P$11(VMB)
Unconnected: CAN_DRV_A.5(VREF) CAN_DRV_B.5(VREF) DRV_DC1.14(VPROPI) DRV_DC1.15(!FAULT) DRV_DC2.14(VPROPI) DRV_DC2.15(!FAULT) DRV_DC3.14(VPROPI) DRV_DC3.15(!FAULT) DRV_DC4.14(VPROPI) DRV_DC4.15(!FAULT) DRV_DC5.14(VPROPI) DRV_DC5.15(!FAULT) DRV_DC6.14(VPROPI) DRV_DC6.15(!FAULT) DRV_DC7.14(VPROPI) DRV_DC7.15(!FAULT) DRV_DC8.14(VPROPI) DRV_DC8.15(!FAULT) FDP_BOT.P$1 FDP_BOT.P$6 FDP_BOT.P$15 FDP_BOT.P$17 FDP_BOT.P$19 FDP_BOT.P$21 FDP_TOP.P$5 FDP_TOP.P$7 FDP_TOP.P$9 FDP_TOP.P$11 FDP_TOP.P$13 FDP_TOP.P$19 FDP_TOP.P$21 FDP_TOP.P$23 FDP_TOP.P$25 STEP_DRIVER_1.P$18(!FAULT) UCC.14(NC1) UCC.15(NC2) UFTDI.2(DTR) UFTDI.3(RTS) UFTDI.11(CTS) UFTDI.17(3V3OUT) X1.VBUS

## Notes on the sheet
- UCs
- Debug USB interface | CAN Interfaces
- DC Motors bridges
- Decoupling & capa stuff
- LEDs
- Stepper motors drivers | Analog Servos opto-isolation
- Analog Servos Connectors | Digital Servos Connectors | DC Motors Connectors | IGreplane Connectors
- 8-45V
- Power-supplies assignation: | Power supply regulation:
- * VDDD: Regulated +5V (low-power)
- * VP1: Power +5V, to Analog Servos
- Analog IOs Connectors | Digital IOs Connectors | Stepper Motors Connectors
- * VP2: Power +10V, to Digital Servos
- * VP3: Power +12V, to DC Motors
- * VP4: (Unused here)
- * VP5: Power +12V, to Stepper Motors
- Jumper Grounds
- Encoders Connectors | ICSP Connectors | USB Connector

## Library data of the parts
C1 = SparkFun-Passives:CAP_POL: Capacitor Polarized These are standard SMD and PTH capacitors. Normally 10uF, 47uF, and 100uF in electrolytic and tantalum varieties. Always verify the external diameter of the through hole cap, it varies with capacity, voltage, and manufacturer. The EIA devices should be standard.
C3V3_STEP1 CCP_SM1 CDEC_A_1-CDEC_A_3 CDEC_B_1-CDEC_B_3 CDEC_C CDEC_CAN_A CDEC_CAN_B CDEC_FTDI1 CDEC_FTDI2 CP2_DC1-CP2_DC8 CP_DC1-CP_DC8 CP_SM1 CS2_DC1-CS2_DC8 CX1_B CX2_B = 0SBLib:C
CAN_DRV_A CAN_DRV_B = 0SBLib:MCP2551: High-Speed CAN Transceiver
CCAP_A CCAP_B = SparkFun:CAP: Capacitor Standard 0603 ceramic capacitor, and 0.1" leaded capacitor.
CS1_DC1-CS1_DC8 = SparkFun:CAP_POL: Capacitor Polarized These are standard SMD and PTH capacitors. Normally 10uF, 47uF, and 100uF in electrolytic and tantalum varieties. Always verify the external diameter of the through hole cap, it varies with capacity, voltage, and manufacturer. The EIA devices should be standard.
DC_M1-DC_M8 = SparkFun:M02: Header 2 Standard 2-pin 0.1" header. Use with straight break away headers (SKU : PRT-00116), right angle break away headers (PRT-00553), swiss pins (PRT-00743), machine pins (PRT-00117), and female headers (PRT-00115). Molex polarized connector foot print use with SKU : PRT-08233 with associated crimp pins and housings.
DRV_DC1-DRV_DC8 = 0SBLib:DRV8801
ENC1-ENC4 = SparkFun:M05: Header 5 Standard 5-pin 0.1" header. Use with straight break away headers (SKU : PRT-00116), right angle break away headers (PRT-00553), swiss pins (PRT-00743), machine pins (PRT-00117), and female headers (PRT-00115). Molex polarized connector foot print use with SKU : PRT-08230 with associated crimp pins and housings.
FDP_BOT FDP_TOP = 0SBLib:CON_26
IA_1-IA_8 IO_1-IO_8 SERVO1-SERVO8 SERVO_DIG_1 SERVO_DIG_2 = SparkFun:M03: Header 3 Standard 3-pin 0.1" header. Use with straight break away headers (SKU : PRT-00116), right angle break away headers (PRT-00553), swiss pins (PRT-00743), machine pins (PRT-00117), and female headers (PRT-00115). Molex polarized connector foot print use with SKU : PRT-08232 with associated crimp pins and housings.
ICSP_A ICSP_B ICSP_C = SparkFun:PIC-ICSP-MINI: PIC-ICSP-Mini Miniature 5-pin connection for temporary programming of PICs. Use this device in your design to save space. Program the PIC with this adapter Spark Fun Electronics SKU : BOB-00194
JP_GND = SparkFun-Passives:JUMPER-2: Jumper Basic 0.1" spaced jumper. Use with breakaway headers.
JP_URX JP_UTX = 0SBLib:JUMPER-3
JPRST_A JPRST_B JPRST_C = SparkFun:JUMPER-2: Jumper Basic 0.1" spaced jumper. Use with breakaway headers.
LED_A LED_B LED_C LED_RX LED_TX = SparkFun:LED: LEDs Standard schematic elements and footprints for 5mm, 3mm, 1206, and 0603 sized LEDs. 5mm - Spark Fun Electronics SKU : COM-00529 (and others)
OPTO_1 OPTO_2 = lib_paul:ACPL-247
R1_DC1-R1_DC8 R2_DC1-R2_DC8 RDECAY1_SM1 RDECAY2_SM1 RHOME_SM1 RISENA_SM1 RISENB_SM1 RLA RLB RLC RLRX RLTX RMCLR_A RMCLR_B RMCLR_C ROL_1-ROL_8 ROP_1-ROP_8 RREF1_SM1 RREF2_SM1 RS_CAN_A RS_CAN_B RSDIG = 0SBLib:R
REG_3_3V = 0SBLib:MCP1801
STEP1 = SparkFun:M04: Header 4 Standard 4-pin 0.1" header. Use with straight break away headers (SKU : PRT-00116), right angle break away headers (PRT-00553), swiss pins (PRT-00743), machine pins (PRT-00117), and female headers (PRT-00115). Molex polarized connector foot print use with SKU : PRT-08231 with associated crimp pins and housings. 1MM SMD Version SKU: PRT-10208
STEP_DRIVER_1 = 0SBLib:DRV8824: STEPPER MOTOR CONTROLLER IC
U$3 U$5 U$10 = 0SBLib:LOGO
UCA UCB = 0SBLib:DSPIC33FJ128MC804: High-Performance,16-bit Digital Signal Controller
UCC = lib_paul:PIC16F1825
UFTDI = SparkFun:FT232RL-BASIC: USB UART This is the simplified version of the FT232RL unit. Only what you need, nothing you don't. Spark Fun Electronics SKU : COM-00650
X1 = SparkFun:USB: USB Connectors USB-B-PTH is fully proven SKU : PRT-00139 USB-miniB is fully proven SKU : PRT-00587 USB-A-PCB is untested. USB-A-H is throughly reviewed, but untested. Spark Fun Electronics SKU : PRT-00437 USB-B-SMT is throughly reviewed, but untested. Needs silkscreen touching up. USB-A-S has not been used/tested USB-MB-H has not been used/tested
XB = 0SBLib:XTAL